# Altium schematic sheet Performance Logger.SchDoc
size Letter; Origin: Eagle
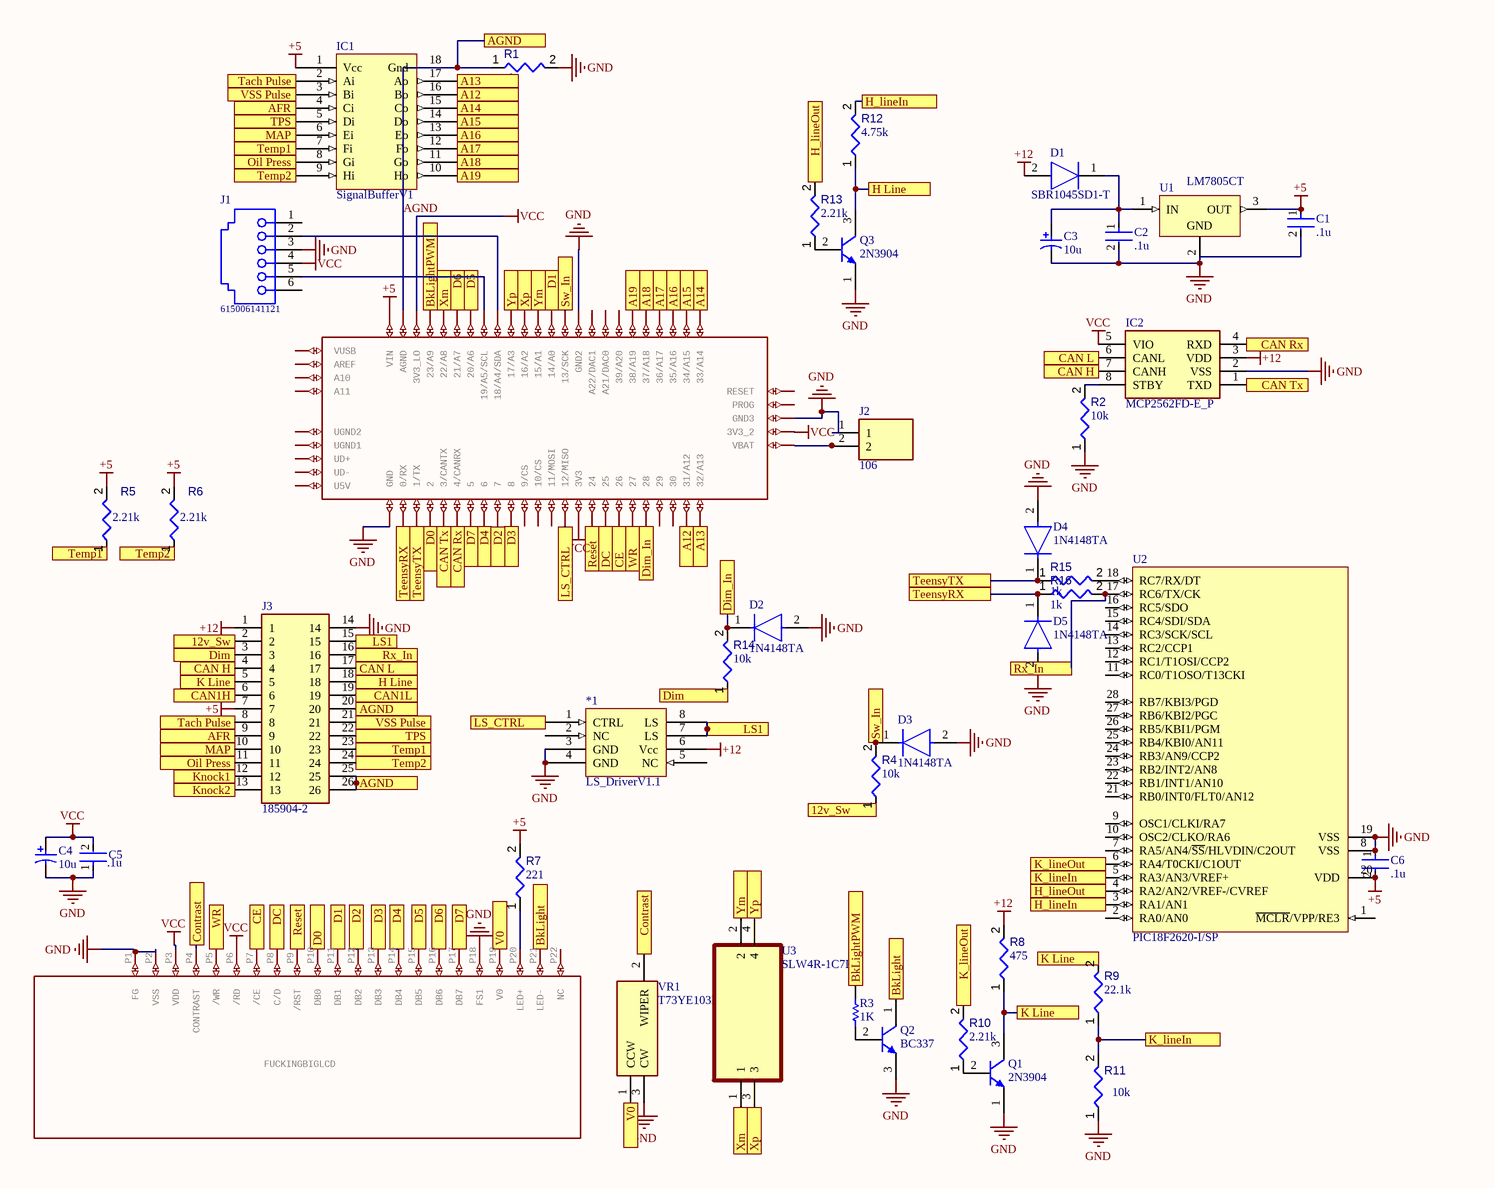
[diagram p0: Performance Logger.SchDoc]

## Parts
*1  LS_DriverV1.1  [LS_DriverV1.1]
C1  .1u  [FP-K105Z20Y5VF5TL2-MFG]
C2  .1u  [FP-K105Z20Y5VF5TL2-MFG]
C3  10u  [CAPPR55-200-1100X500X1200]
C4  10u  [CAPPR55-200-1100X500X1200]
C5  .1u  [FP-K105Z20Y5VF5TL2-MFG]
C6  .1u  [FP-K105Z20Y5VF5TL2-MFG]
D1  SBR1045SD1-T  [DO-201AD]
D2  1N4148TA  [FP-017AG-MFG]
D3  1N4148TA  [FP-017AG-MFG]
D4  1N4148TA  [FP-017AG-MFG]
D5  1N4148TA  [FP-017AG-MFG]
FUCKINGBIGLCD  BIIIGGG_DEVICE  [BIIIGGG_FOOTPRINT]  (value not drawn)
IC1  SignalBufferV1  [DIP18]
IC2  MCP2562FD-E_P  [DIP781W56P254L950H533Q8N]
J1  615006141121  [615006141121]
J2  106  [106_1]
J3  185904-2  [1859042]
Q1  2N3904  [ONSC-TO-92-3-29-11]
Q2  BC337  [ONSC-TO-92-3-29-11]
Q3  2N3904  [ONSC-TO-92-3-29-11]
R1  value 1k  [RESA60-630X240]  (hidden comment: MFR-25FBF52-1K)
R2  value 10k  [RESA60-630X240]  (hidden comment: MFR-25FBF52-10K)
R3  1K  [RESA60-630X240]
R4  value 10k  [RESA60-630X240]  (hidden comment: MFR-25FBF52-10K)
R5  value 2.21k  [RESA60-630X240]  (hidden comment: MFR-25FBF52-2K21)
R6  value 2.21k  [RESA60-630X240]  (hidden comment: MFR-25FBF52-2K21)
R7  value 221  [RESA60-630X240]  (hidden comment: MFR-25FBF52-221R)
R8  value 475  [RESA60-630X240]  (hidden comment: MFR-25FBF52-475R)
R9  value 22.1k  [RESA60-630X240]  (hidden comment: MFR-25FBF52-22K1)
R10  value 2.21k  [RESA60-630X240]  (hidden comment: MFR-25FBF52-2K21)
R11  value 10k  [RESA60-630X240]  (hidden comment: MFR-25FBF52-10K)
R12  value 4.75k  [RESA60-630X240]  (hidden comment: MFR-25FBF52-4K75)
R13  value 2.21k  [RESA60-630X240]  (hidden comment: MFR-25FBF52-2K21)
R14  value 10k  [RESA60-630X240]  (hidden comment: MFR-25FBF52-10K)
R15  value 1k  [RESA60-630X240]  (hidden comment: MFR-25FBF52-1K)
R16  value 1k  [RESA60-630X240]  (hidden comment: MFR-25FBF52-1K)
U1  LM7805CT  [FAIR-TO-220-3]
U2  PIC18F2620-I/SP  [SPDIP300-SP28]
U3  SLW4R-1C7LF  [FCI_SLW4R-1C7LF]
U$1  TEENSY_3.5/3.6  [TEENSY_3.5/3.6]  (value not drawn)
VR1  T73YE103KT20  [T73YE103KT20]

## Ports
12v_Sw, A12, A13, A14, A15, A16, A17, A18, A19, AFR, AGND, BkLight, BkLightPWM, CAN1H, CAN1L, CAN H, CAN L, CAN Rx, CAN Tx, CE, Contrast, D0 (in), D1, D2, D3, D4, D5, D6, D7, DC, Dim, Dim_In, H Line, H_lineIn, H_lineOut, K Line, K_lineIn, K_lineOut, Knock1, Knock2, LS1, LS_CTRL, MAP, Oil Press, Reset, Rx_In, Sw_In, Tach Pulse, TeensyRX, TeensyTX, Temp1, Temp2, TPS, V0, VSS Pulse, WR, Xm, Xp, Ym, Yp

## Nets
+5: C1.1 C6.2 IC1.1(Vcc) J3.7 R5.2 R6.2 R7.2 U1.3(OUT) U2.20(VDD) U$1.VIN
+12: *1.6(Vcc) D1.2(A) IC2.3(VDD) J3.1 R8.2
GND: *1.3(GND) *1.4(GND) C1.2 C2.2 C3.2 C4.2 C5.1 C6.1 D2.2(A) D3.2(A) D4.2(A) D5.2(A) FUCKINGBIGLCD.P1(FG) FUCKINGBIGLCD.P2(VSS) FUCKINGBIGLCD.P18(FS1) IC2.2(VSS) J1.3 J2.1 J3.14 Q1.1(E) Q2.3(E) Q3.1(E) R1.2 R2.1 R11.1 U1.2(GND) U2.8(VSS) U2.19(VSS) U$1.GND U$1.GND2 U$1.GND3 VR1.3(CW)
VCC: C4.1 C5.2 FUCKINGBIGLCD.P3(VDD) FUCKINGBIGLCD.P6(/RD) IC2.5(VIO) J1.4 U$1.3V3 U$1.3V3_2 U$1.3V3_LO
12v_Sw: J3.2 R4.1 ; port 12v_Sw
A12: IC1.16(Bo) U$1.31/A12 ; port A12
A13: IC1.17(Ao) U$1.32/A13 ; port A13
A14: IC1.15(Co) U$1.33/A14 ; port A14
A15: IC1.14(Do) U$1.34/A15 ; port A15
A16: IC1.13(Eo) U$1.35/A16 ; port A16
A17: IC1.12(Fo) U$1.36/A17 ; port A17
A18: IC1.11(Go) U$1.37/A18 ; port A18
A19: IC1.10(Ho) U$1.38/A19 ; port A19
AFR: IC1.4(Ci) J3.9 ; port AFR
AGND: IC1.18(Gnd) J3.20 J3.25 J3.26 R1.1 U$1.AGND ; port AGND
BkLight: FUCKINGBIGLCD.P21(LED-) Q2.1(C) ; port BkLight
BkLightPWM: R3.2 U$1.23/A9 ; port BkLightPWM
CAN1H: J3.6 ; port CAN1H
CAN1L: J3.19 ; port CAN1L
CAN H: IC2.7(CANH) J3.4 ; port CAN H
CAN L: IC2.6(CANL) J3.17 ; port CAN L
CAN Rx: IC2.4(RXD) U$1.4/CANRX ; port CAN Rx
CAN Tx: IC2.1(TXD) U$1.3/CANTX ; port CAN Tx
CE: FUCKINGBIGLCD.P7(/CE) U$1.26 ; port CE
Contrast: FUCKINGBIGLCD.P4(CONTRAST) VR1.2(WIPER) ; port Contrast
D0: FUCKINGBIGLCD.P10(DB0) U$1.2 ; port D0
D1: FUCKINGBIGLCD.P11(DB1) U$1.14/A0 ; port D1
D2: FUCKINGBIGLCD.P12(DB2) U$1.7 ; port D2
D3: FUCKINGBIGLCD.P13(DB3) U$1.8 ; port D3
D4: FUCKINGBIGLCD.P14(DB4) U$1.6 ; port D4
D5: FUCKINGBIGLCD.P15(DB5) U$1.20/A6 ; port D5
D6: FUCKINGBIGLCD.P16(DB6) U$1.21/A7 ; port D6
D7: FUCKINGBIGLCD.P17(DB7) U$1.5 ; port D7
DC: FUCKINGBIGLCD.P8(C/D) U$1.25 ; port DC
Dim: J3.3 R14.1 ; port Dim
Dim_In: D2.1(C) R14.2 U$1.28 ; port Dim_In
H Line: J3.18 Q3.3(C) R12.1 ; port H Line
H_lineIn: R12.2 U2.3(RA1/AN1) ; port H_lineIn
H_lineOut: R13.2 U2.4(RA2/AN2/VREF-/CVREF) ; port H_lineOut
K Line: J3.5 Q1.3(C) R8.1 R9.2 ; port K Line
K_lineIn: R9.1 R11.2 U2.5(RA3/AN3/VREF+) ; port K_lineIn
K_lineOut: R10.2 U2.6(RA4/T0CKI/C1OUT) ; port K_lineOut
Knock1: J3.12 ; port Knock1
Knock2: J3.13 ; port Knock2
LS1: *1.7(LS) *1.8(LS) J3.15 ; port LS1
LS_CTRL: *1.1(CTRL) U$1.12/MISO ; port LS_CTRL
MAP: IC1.6(Ei) J3.10 ; port MAP
Oil Press: IC1.8(Gi) J3.11 ; port Oil Press
Reset: FUCKINGBIGLCD.P9(/RST) U$1.24 ; port Reset
Rx_In: J3.16 R16.2 U2.17(RC6/TX/CK) ; port Rx_In
Sw_In: D3.1(C) R4.2 U$1.13/SCK ; port Sw_In
Tach Pulse: IC1.2(Ai) J3.8 ; port Tach Pulse
TeensyRX: D5.1(C) R16.1 U$1.0/RX ; port TeensyRX
TeensyTX: D4.1(C) R15.1 U$1.1/TX ; port TeensyTX
Temp1: IC1.7(Fi) J3.23 R5.1 ; port Temp1
Temp2: IC1.9(Hi) J3.24 R6.1 ; port Temp2
TPS: IC1.5(Di) J3.22 ; port TPS
V0: FUCKINGBIGLCD.P19(V0) VR1.1(CCW) ; port V0
VSS Pulse: IC1.3(Bi) J3.21 ; port VSS Pulse
WR: FUCKINGBIGLCD.P5(/WR) U$1.27 ; port WR
Xm: U3.1 U$1.22/A8 ; port Xm
Xp: U3.3 U$1.16/A2 ; port Xp
Ym: U3.2 U$1.15/A1 ; port Ym
Yp: U3.4 U$1.17/A3 ; port Yp
NetC2_1: C2.1 C3.1 D1.1(K) U1.1(IN)
NetFUCKINGBIGLCD_P20: FUCKINGBIGLCD.P20(LED+) R7.1
NetIC2_8: IC2.8(STBY) R2.2
NetJ1_2: J1.2 U$1.18/A4/SDA
NetJ1_5: J1.5 U$1.19/A5/SCL
NetJ2_2: J2.2 U$1.VBAT
NetQ1_2: Q1.2(B) R10.1
NetQ2_2: Q2.2(B) R3.1
NetQ3_2: Q3.2(B) R13.1
NetR15_2: R15.2 U2.18(RC7/RX/DT)

Not connected (* = marked no-connect by the designer): *1 2(NC) 5(NC); FUCKINGBIGLCD P22(NC); J1 1 6; U2 1(~{MCLR}/VPP/RE3) 2(RA0/AN0) 7(RA5/AN4/~{SS}/HLVDIN/C2OUT) 9(OSC1/CLKI/RA7) 10(OSC2/CLKO/RA6) 11(RC0/T1OSO/T13CKI) 12(RC1/T1OSI/CCP2) 13(RC2/CCP1) 14(RC3/SCK/SCL) 15(RC4/SDI/SDA) 16(RC5/SDO) 21(RB0/INT0/FLT0/AN12) 22(RB1/INT1/AN10) 23(RB2/INT2/AN8) 24(RB3/AN9/CCP2) 25(RB4/KBI0/AN11) 26(RB5/KBI1/PGM) 27(RB6/KBI2/PGC) 28(RB7/KBI3/PGD); U$1 9/CS 10/CS 11/MOSI 21/DAC0(A21/DAC0) 29 30 39/A20 A10 A11 A22/DAC1 AREF PROG RESET U5V UD+ UD- UGND1 UGND2 VUSB

## Library data of the parts
*1 = CMP-001-0000-1: 10A capable Low side Switch in an 8dip
C1 C2 C5 C6 = CMP-02417-000003-1: CAP CER 1UF 50V Y5V RADIAL; Manufacturer Part Number: K105Z20Y5VF5TL2; Manufacturer: Vishay BC Components; Tolerance: -20+80%; Material: Ceramic; Capacitance: 1uF; Temperature Characteristic: Y5V; Mouser Description: Multilayer Ceramic Capacitors MLCC - Leaded 1uF 50volts +80/-20% Y5V 2.5mm LS; Lead Free: Yes; RoHS: TRUE; Voltage Rating: 50V; Device Class L1: Passive Components; Octopart: https://octopart.com/k105z20y5vf5tl2-vishay-39475252; Temperature Range Low: -30°C; Digikey Description: CAP CER 1UF 50V Y5V RADIAL; Device Class L2: Capacitors; Temperature: -30°C to +85°C; Package: K105Z20Y5VF5TL2; Temperature Range High: +85°C; ComponentLink2Description: Datasheet; Value: 1uF; Category: Cap; Height: 6.6mm; ComponentLink2URL: https://www.vishay.com/docs/45171/kseries.pdf; Device Class L3: Ceramic Capacitors; Automotive: No
C3 C4 = CMP-1665-00038-2: Aluminum Electrolytic Capacitor, 10 uF, +/- 20%, 50 V, -40 to 85 degC, 2-Pin THD, RoHS, Bulk; Manufacturer: Panasonic; Life (Hours): 2000Hour; Lead/Base Style: Straight; Dissipation Factor: 0.12%; Capacitance: 10uF; Leakage Current: 3uA; Dielectric Material: Aluminium; Lead Diameter: 0.5mm; Voltage Rating: 50V; Ripple Current: 65mA; Package Reference: CAPPR55-200-1100X500X1200; Height: 11mm; Diameter: 5mm; REACH SVHC: NoSVHC; Mount: ThroughHole; Packaging: Bulk; Manufacturer URL: http://www.panasonic.com/; Termination: Radial; Datasheet URL: https://industrial.panasonic.com/cdbs/www-data/pdf/RDF0000/ABA0000C1218.pdf; Lead Free: LeadFree; Height - Seated (Max): 0.472inch; Case/Package: Radial; Package Description: 2-Pin Radial Lead, Dia 5 mm, Height 12 mm; Tolerance: 20%; Datasheet Version: Rev. 05, 10/2016; Package Quantity: 200; Ripple Current (AC): 65mA; Min Operating Temperature: -40degC; RoHSCompliant: true; Number of Pins: 2; Max Operating Temperature: 85degC; Voltage: 50V; Lead Pitch: 2mm; Radiation Hardening: No; Voltage Rating (DC): 50V; Length: 11mm
D1 = SBR1045SD1-T: Diode; Manufacturer_Name: Diodes Inc.; Datasheet Link: https://static6.arrow.com/aropdfconversion/e9ac78d29ec4e1440bcb8a4d828fb4ad9c4e4821/sbr1045sd1.pdf; Manufacturer_Part_Number: SBR1045SD1-T; Mouser Part Number: 621-SBR1045SD1-T; Mouser Price/Stock: https://www.mouser.co.uk/ProductDetail/Diodes-Incorporated/SBR1045SD1-T?qs=aXnpsjvrXd14ZHU8QjK7zA%3D%3D; Arrow Part Number: SBR1045SD1-T; Arrow Price/Stock: https://www.arrow.com/en/products/sbr1045sd1-t/diodes-incorporated
D2-D5 = CMP-07163-000009-1: DIODE GEN PURP 100V 200MA DO35; Manufacturer: ON Semiconductor; Value: 4pF; Max Surge Forward Current: 1A; Max Junction Temp: +175°C; Peak Reverse Current: 5uA; Package: 017AG; Category: Diode; Manufacturer Part Number: 1N4148TA; Temperature: -55°C to +175°C; Device Class L2: Diodes; Octopart: https://octopart.com/1n4148ta-on+semiconductor-84323124; Lead Free: Yes; RoHS: TRUE; Digikey Description: DIODE GEN PURP 100V 200MA DO35; Temperature Range High: +175°C; Height: 1.91mm; Reverse Voltage: 100V; ComponentLink2Description: Datasheet; Temperature Range Low: -55°C; ComponentLink2URL: https://www.onsemi.com/pub/Collateral/1N914A-D.pdf; Capacitance: 4pF; Forward Current: 200mA; Max Repetitive Reverse Voltage: 100V; Device Class L3: Rectifier Diodes; Device Class L1: Discrete Semiconductors; Automotive: No; Footprint Url: https://www.onsemi.com/pub/Collateral/017AG.PDF
FUCKINGBIGLCD = BIIIGGG_DEVICE: BiggLCD; GateName_1: G$1; SymbolName_1: BIIIGGG_SYMBOL; LibraryName: Biiiggg LCD; DeviceSetName: BIIIGGG_DEVICE
IC1 = SignalBufferV1-7: Signal Buffer Board
IC2 = MCP2562FD-E_P: Integrated Circuit; Manufacturer_Name: Microchip; Manufacturer_Part_Number: MCP2562FD-E/P; Datasheet Link: https://componentsearchengine.com/Datasheets/2/MCP2562FD-E_P.pdf; Height: 5.334mm; Mouser Part Number: 579-MCP2562FD-E/P; Mouser Price/Stock: https://www.mouser.co.uk/ProductDetail/Microchip-Technology/MCP2562FD-E-P?qs=YlpJWyuQ3PMgzspdOlrnPg%3D%3D; Arrow Part Number: MCP2562FD-E/P; Arrow Price/Stock: https://www.arrow.com/en/products/mcp2562fd-ep/microchip-technology
J1 = CMP-1502-01674-1: Modular Jack WR-MJ, Tab Down, Plastic, Horizontal Entry, THT, 6P6C; Manufacturer: Wurth Elektronik; Compliance: Leadfree/RoHS; Contact Resistance: 20mOhm; Port: 1x1; Rated Current: 1.5A; Withstanding Voltage: 1000VAC; Working Voltage: 120VAC; Packaging: Tray; Publisher: WurthElektronik; Part Number: 615006141121; Operating Temperature: -40to85degC; Datasheet URL: https://katalog.we-online.com/em/datasheet/615006141121.pdf; Pin Number: 6P6C; Mounting Technology: THT; Manufacturer URL: http://www.we-online.de; Package Reference: 615006141121; Entrance: Horizontal
J2 = 106: Connector; Manufacturer_Name: Keystone Electronics; Datasheet Link: http://docs-emea.rs-online.com/webdocs/002b/0900766b8002b5fd.pdf; Manufacturer_Part_Number: 106; Mouser Part Number: 534-106; Mouser Price/Stock: https://www.mouser.co.uk/ProductDetail/Keystone-Electronics/106?qs=Q3RoVmURDolnMuconA2vXg%3D%3D; Arrow Part Number: 106; Arrow Price/Stock: https://www.arrow.com/en/products/106/keystone-electronics
J3 = 185904-2: Connector; Manufacturer_Name: TE Connectivity; Datasheet Link: http://www.te.com/commerce/DocumentDelivery/DDEController?Action=srchrtrv&DocNm=185904&DocType=Customer+Drawing&DocLang=English&DocFormat=pdf&PartCntxt=1-185904-2; Height: 17mm; Manufacturer_Part_Number: 185904-2; Mouser Part Number: 571-185904-2; Mouser Price/Stock: https://www.mouser.co.uk/ProductDetail/TE-Connectivity-AMP/185904-2?qs=UMrTGIqlm7mWBHkoAKrGLw%3D%3D; Arrow Part Number: 185904-2; Arrow Price/Stock: https://www.arrow.com/en/products/185904-2/te-connectivity
Q1 Q3 = CMP-2000-05562-1: General Purpose Transistor, NPN Silicon, 200 mA, 60 V, -55 to 150 degC, 3-Pin TO-92, RoHS, Bulk; Manufacturer: ONSemiconductor; Emitter- Base Voltage VEBO: 6V; Maximum Power Dissipation: 625mW; Maximum DC Collector Current: 0.2A; Collector- Emitter Voltage VCEO Max: 40V; Collector- Base Voltage VCBO: 60V; DC Collector/Base Gain hfe Min: 60; Configuration: Single; Collector-Emitter Saturation Voltage: 0.3V; Gain Bandwidth Product fT: 270MHz; Mounting Style: ThroughHole; Package / Case: TO-92-3(TO-226); Mounting Technology: ThroughHole; Minimum Operating Temperature: -65C; Datasheet Version: Rev. 8, 08/2012; Product Category: BipolarTransistors-BJT; Factory Pack Quantity: 5000; Transistor Polarity: NPN; Package Description: 3-Pin Transistor Outline, Body 4.825 x 3.685 mm, Pitch 1.27 mm; RoHS: Details; Datasheet URL: https://datasheet.ciiva.com/4725/2n3903-d-285841-4725808.pdf; Packaging: Bulk; Maximum Operating Temperature: +150C; Package Reference: TO-92-3-29-11; Brand: ONSemiconductor; Manufacturer URL: http://www.onsemi.com/
Q2 = CMP-1048-01458-1: Amplifier Transistor, NPN Silicon, 3-Pin TO-92, Bulk Box; Manufacturer: On Semiconductor; Note1: 0; IC Continuous (A): 0.8; ComponentLink1URL: http://www.onsemi.com/; PackageDescription: 3-Pin Transistor Outline, Body 4.825 x 3.685 mm, Pitch 1.27 mm; ComponentLink3URL: http://www.onsemi.cn/pub_link/Collateral/2N6426-D.PDF; ComponentLink1Description: Manufacturer URL; PackageVersion: Rev. AM; Polarity: NPN; PackageReference: TO-92-3-29-11_AM_SL; DatasheetVersion: Rev. 8; ComponentLink2URL: http://www.onsemi.com/pub_link/Collateral/BC337-D.PDF; Packing: Bulk Box; PartNumber: BC337; RoHS: FALSE; ComponentLink3Description: Package Specification; Mounting Technology: Through Hole; ComponentLink2Description: Datasheet
R1 R15 R16 = CMP-009-00048-4: Axial Resistor, 1 KOhm, +/- 1%, 250 mW, -55 to 155 degC, 2-Pin THD, RoHS, Bulk; Manufacturer: Yageo; Voltage Rating: 250V; Power: 250mW; Min Operating Temperature: -55°C; Max Operating Temperature: 155°C; Tolerance: 1%; Package Reference: MFR-25; Composition: CarbonFilm; Mounting Technology: TH; Packaging: Bulk; Case/Package: Axial; Datasheet URL: http://www.yageo.com/documents/recent/Yageo%20LR_MFR_2013.pdf; Package Quantity: 200; Manufacturer URL: http://www.yageo.com/; Package Description: 2-Pin Axial Lead, Dia 2.4 mm, Body Length 6.3 mm; Datasheet Version: Apr-13; RoHS Compliant: True
R2 R4 R11 R14 = CMP-009-00047-4: Axial Resistor, 10 KOhm, +/- 1%, 0.25 W, -55 to 155 degC, 2-Pin THD, RoHS, Bulk; Manufacturer: Yageo; Power: 250mW; Voltage Rating: 250V; Manufacturer URL: http://www.yageo.com/; Datasheet URL: http://www.yageo.com/documents/recent/Yageo%20LR_MFR_2013.pdf; Package Reference: MFR-25; Min Operating Temperature: -55°C; Mounting Technology: TH; Package Quantity: 200; Case/Package: Axial; Tolerance: 1%; RoHS Compliant: True; Datasheet Version: Apr-13; Packaging: Bulk; Max Operating Temperature: 155°C; Package Description: 2-Pin Axial Lead, Dia 2.4 mm, Body Length 6.3 mm
R3 = CMP-1659-00075-1: Axial Resistor, 1 KOhm, +/- 1%, 250 mW, -55 to 155 degC, 2-Pin THD, RoHS, Bulk; Voltage Rating: 250 V; Resistance: 10 kohm; Power Rating: 250 mW; ComponentLink2Description: Datasheet; RoHSCompliant: true; PackageReference: MFR-25; Case\Package: Axial; Max Operating Temperature: 155 degC; DatasheetVersion: Apr-13; Tolerance: 1%; ComponentLink1URL: http://www.yageo.com/; Length: 0.248 inch; ComponentLink2URL: http://www.yageo.com/documents/recent/Yageo%20LR_MFR_2013.pdf; Packaging: Bulk; Package Quantity: 200; PackageDescription: 2-Pin Axial Lead, Dia 2.4 mm, Body Length 6.3 mm; Min Operating Temperature: -55 degC; ComponentLink1Description: Manufacturer URL
R5 R6 R10 R13 = CMP-009-00054-4: Axial Resistor, 2.21 KOhm, +/- 1%, 0.25 W, -55 to 155 degC, 2-Pin THD, RoHS, Bulk; Manufacturer: Yageo; Voltage Rating: 250V; Power: 250mW; Tolerance: 1%; Package Reference: MFR-25; Packaging: Bulk; Datasheet Version: Apr-13; Manufacturer URL: http://www.yageo.com/; Package Description: 2-Pin Axial Lead, Dia 2.4 mm, Body Length 6.3 mm; Mounting Technology: TH; RoHS Compliant: True; Package Quantity: 200; Min Operating Temperature: -55°C; Case/Package: Axial; Max Operating Temperature: 155°C; Datasheet URL: http://www.yageo.com/documents/recent/Yageo%20LR_MFR_2013.pdf
R7 = CMP-009-00051-4: Axial Resistor, 221 Ohm, +/- 1%, 250 mW, -55 to 155 degC, 2-Pin THD, RoHS, Bulk; Manufacturer: Yageo; Power: 250mW; Voltage Rating: 250V; Package Quantity: 200; Manufacturer URL: http://www.yageo.com/; Case/Package: Axial; Package Reference: MFR-25; RoHS Compliant: True; Mounting Technology: TH; Datasheet URL: http://www.yageo.com/documents/recent/Yageo%20LR_MFR_2013.pdf; Packaging: Bulk; Package Description: 2-Pin Axial Lead, Dia 2.4 mm, Body Length 6.3 mm; Max Operating Temperature: 155°C; Tolerance: 1%; Datasheet Version: Apr-13; Min Operating Temperature: -55°C
R8 = CMP-009-00056-4: Axial Resistor, 475 Ohm, +/- 1%, 0.25 W, -55 to 155 degC, 2-Pin THD, RoHS, Bulk; Manufacturer: Yageo; Voltage Rating: 250V; Power: 250mW; Case/Package: Axial; Datasheet URL: http://www.yageo.com/documents/recent/Yageo%20LR_MFR_2013.pdf; Tolerance: 1%; RoHS Compliant: True; Mounting Technology: TH; Packaging: Bulk; Package Description: 2-Pin Axial Lead, Dia 2.4 mm, Body Length 6.3 mm; Max Operating Temperature: 155°C; Package Reference: MFR-25; Datasheet Version: Apr-13; Min Operating Temperature: -55°C; Package Quantity: 200; Manufacturer URL: http://www.yageo.com/
R9 = CMP-009-00052-4: Axial Resistor, 22.1 KOhm, +/- 1%, 0.25 W, -55 to 155 degC, 2-Pin THD, RoHS, Bulk; Manufacturer: Yageo; Power: 250mW; Voltage Rating: 250V; Packaging: Bulk; Max Operating Temperature: 155°C; Case/Package: Axial; Tolerance: 1%; Mounting Technology: TH; Min Operating Temperature: -55°C; RoHS Compliant: True; Package Quantity: 200; Package Reference: MFR-25; Manufacturer URL: http://www.yageo.com/; Package Description: 2-Pin Axial Lead, Dia 2.4 mm, Body Length 6.3 mm; Datasheet Version: Apr-13; Datasheet URL: http://www.yageo.com/documents/recent/Yageo%20LR_MFR_2013.pdf
R12 = CMP-009-00059-4: Axial Resistor, 4.75 KOhm, +/- 1%, 0.25 W, -55 to 155 degC, 2-Pin THD, RoHS, Bulk; Manufacturer: Yageo; Voltage Rating: 250V; Power: 250mW; Datasheet Version: Apr-13; Mounting Technology: TH; Package Reference: MFR-25; RoHS Compliant: True; Composition: MetalFilm; Datasheet URL: http://www.yageo.com/documents/recent/Yageo%20LR_MFR_2013.pdf; Max Operating Temperature: 155°C; Package Quantity: 200; Case/Package: Axial; Package Description: 2-Pin Axial Lead, Dia 2.4 mm, Body Length 6.3 mm; Tolerance: 1%; Packaging: Bulk; Manufacturer URL: http://www.yageo.com/; Min Operating Temperature: -55°C
U1 = CMP-2000-04938-1: Positive Voltage Regulator, 5 V, 1 A, -40 to 125 degC, 3-Pin TO-220, RoHS, Tube; Manufacturer: FairchildSemiconductor; Maximum Input Voltage: 35V; Maximum Quiescent Current: 8mA; Load Regulation: 100mV; Maximum Output Current: 2.2(Typ)A; Output Type: Fixed; Typical Dropout Voltage @ Current: 2@1AV; Rad Hard: No; Output Voltage: 5V; Accuracy: ±4%; Number of Outputs: 1; Category: LinearRegulator; Package Description: 3-Pin Through Hole Device, Body 10 x 4.5 mm, Pitch 2.54 mm; Packaging: Rail/Tube; Mounting: ThroughHole; Polarity: Positive; Manufacturer URL: https://www.fairchildsemi.com/; Line Regulation: 100mV; Datasheet Version: Aug-12; Datasheet URL: https://datasheet.ciiva.com/26904/lm7805ct-26904988.pdf; Package Reference: TO-220; Package URL: https://www.fairchildsemi.com/package-drawings/TO/TO220B03.pdf; Package: 3TO-220AB; Operating Temperature: -40to125degC; Type: Linear
U2 = CMP-0116-00068-1: Enhanced Flash Microcontroller with 10-Bit A/D and nanoWatt Technology, 64K Flash, 28-Pin PDIP, Industrial Temperature Range; PackageReference: SPDIP300-SP28; PackageVersion: revBB, Aug-2009; DatasheetVersion: revE, May-2008; PackageDescription: 28-Lead Skinny Plastic Dual In-Line (SP) - 300 mil Body [SPDIP]
U3 = SLW4R-1C7LF: 4 Position FFC, FPC Connector Contacts, Bottom 0.039 (1.00mm) Through Hole, Right Angle; MF: Amphenol ICC; SnapEDA_Link: https://www.snapeda.com/parts/SLW4R-1C7LF/Amphenol%20FCI/view-part/31876/?ref=snap; MP: SLW4R-1C7LF; Package: None; DigiKey-Purchase-URL: https://snapeda.com/shop?store=DigiKey&id=31876; Value: *; Digi-Key_Part_Number: 609-1928-ND
U$1 = TEENSY_3.5/3.6: GateName_1: G$1; SymbolName_1: TEENSY_3.5/3.6; LibraryName: Teensy356; DeviceSetName: TEENSY_3.5/3.6
VR1 = T73YE103KT20: Variable Resistor; Manufacturer_Name: Vishay; Datasheet Link: https://www.mouser.com/datasheet/2/427/t73-239983.pdf; Height: 4.7mm; Manufacturer_Part_Number: T73YE103KT20; Mouser Part Number: 72-T70YE-10K; Mouser Price/Stock: https://www.mouser.co.uk/ProductDetail/Vishay-Sfernice/T73YE103KT20?qs=LCMWAU1DZczcFWP7UOhLsQ%3D%3D; Arrow Part Number: T73YE103KT20; Arrow Price/Stock: https://www.arrow.com/en/products/t73ye103kt20/vishay